# Altium schematic sheet WIFI-79.SchDoc
size A4
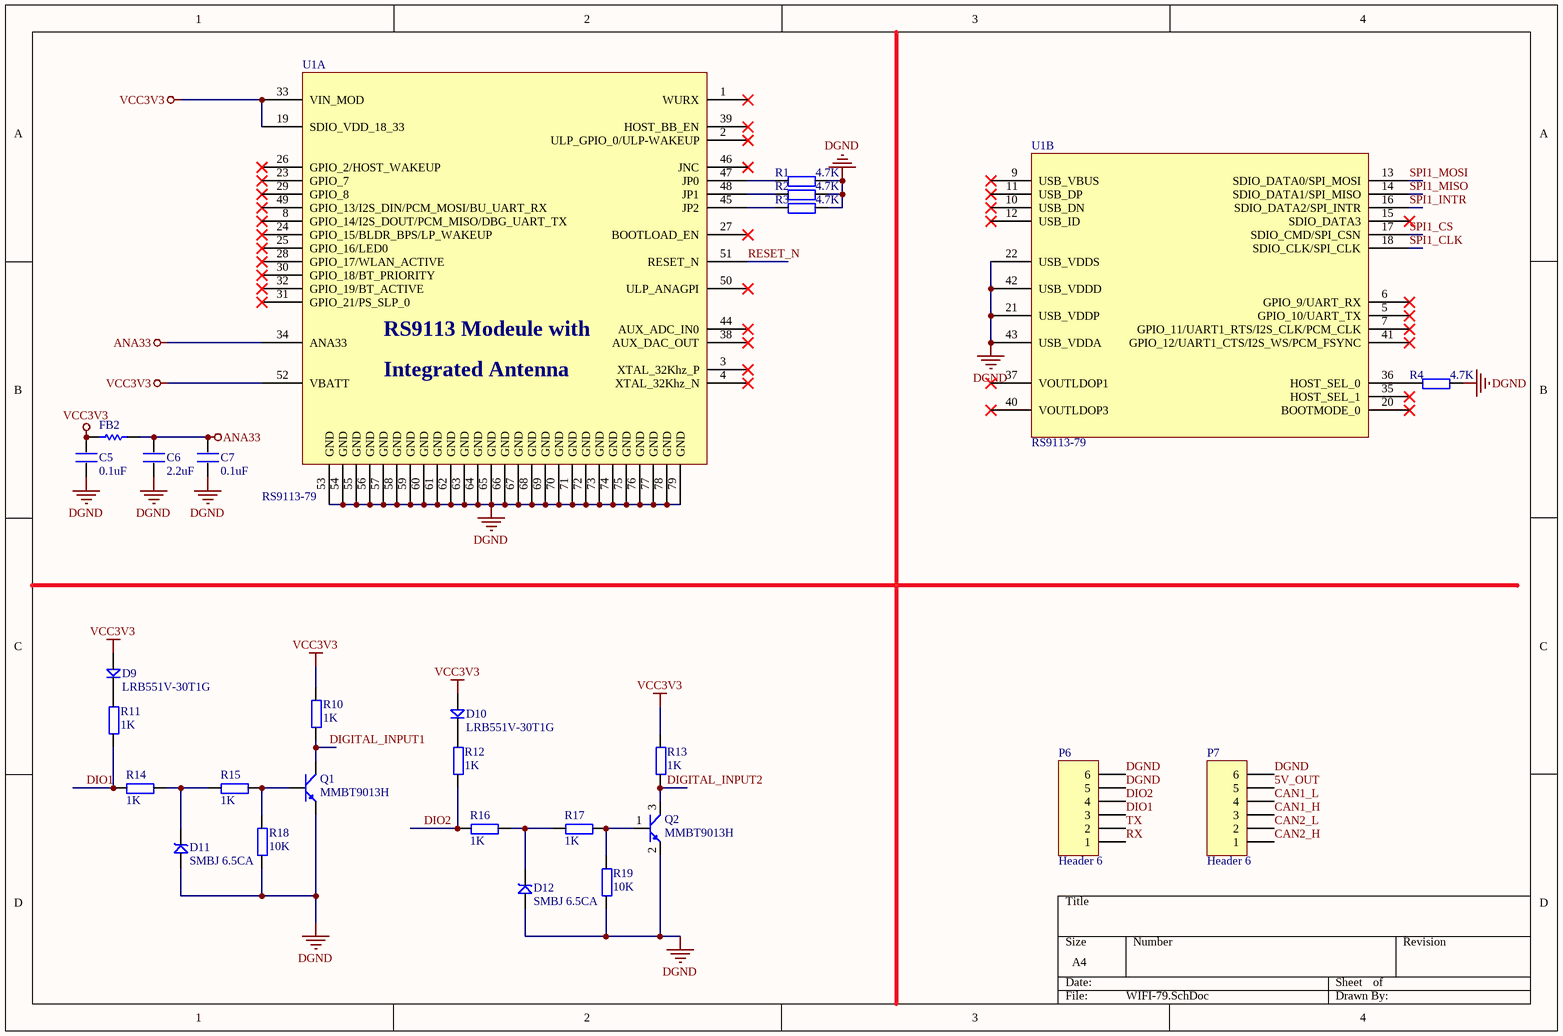
[diagram p0: WIFI-79.SchDoc]

## Parts
C5  0.1uF  [0603]
C6  2.2uF  [0603]
C7  0.1uF  [0603]
D9  LRB551V-30T1G  [SOD-323]
D10  LRB551V-30T1G  [SOD-323]
D11  SMBJ 6.5CA  [DO-214AA]
D12  SMBJ 6.5CA  [DO-214AA]
FB2  BLM15EG121SN1D  [0603]  (value not drawn)
P6  Header 6  [P6]
P7  Header 6  [P6]
Q1  MMBT9013H  [SOT-23]
Q2  MMBT9013H  [SOT-23]
R1  4.7K  [0603]
R2  4.7K  [0603]
R3  4.7K  [0603]
R4  4.7K  [0603]
R10  1K  [0603]
R11  1K  [0603]
R12  1K  [0603]
R13  1K  [0603]
R14  1K  [0603]
R15  1K  [0603]
R16  1K  [0603]
R17  1K  [0603]
R18  10K  [0603]
R19  10K  [0603]
U1  RS9113-79  [RS9113-79]  (parts A,B of 2)

## Nets
ANA33: C6.1 C7.1 FB2.2 U1.34(ANA33)
DGND: C5.2 C6.2 C7.2 D11.1 D12.1 P6.5 P6.6 P7.6 Q1.2(E) Q2.2(E) R1.2 R2.2 R3.2 R4.2 R18.1 R19.1 U1.21(USB_VDDP) U1.22(USB_VDDS) U1.42(USB_VDDD) U1.43(USB_VDDA) U1.53(GND) U1.54(GND) U1.55(GND) U1.56(GND) U1.57(GND) U1.58(GND) U1.59(GND) U1.60(GND) U1.61(GND) U1.62(GND) U1.63(GND) U1.64(GND) U1.65(GND) U1.66(GND) U1.67(GND) U1.68(GND) U1.69(GND) U1.70(GND) U1.71(GND) U1.72(GND) U1.73(GND) U1.74(GND) U1.75(GND) U1.76(GND) U1.77(GND) U1.78(GND) U1.79(GND)
VCC3V3: C5.1 D9.2 D10.2 FB2.1 R10.2 R13.2 U1.19(SDIO_VDD_18_33) U1.33(VIN_MOD) U1.52(VBATT)
5V_OUT: P7.5
CAN1_H: P7.3
CAN1_L: P7.4
CAN2_H: P7.1
CAN2_L: P7.2
DIGITAL_INPUT1: Q1.3(C) R10.1
DIGITAL_INPUT2: Q2.3(C) R13.1
DIO1: P6.3 R11.1 R14.1
DIO2: P6.4 R12.1 R16.1
RESET_N: U1.51(RESET_N)
RX: P6.1
SPI1_CLK: U1.18(SDIO_CLK/SPI_CLK)
SPI1_CS: U1.17(SDIO_CMD/SPI_CSN)
SPI1_INTR: U1.16(SDIO_DATA2/SPI_INTR)
SPI1_MISO: U1.14(SDIO_DATA1/SPI_MISO)
SPI1_MOSI: U1.13(SDIO_DATA0/SPI_MOSI)
TX: P6.2
NetD9_1: D9.1 R11.2
NetD10_1: D10.1 R12.2
NetD11_2: D11.2 R14.2 R15.1
NetD12_2: D12.2 R16.2 R17.1
NetQ1_1: Q1.1(B) R15.2 R18.2
NetQ2_1: Q2.1(B) R17.2 R19.2
NetR1_1: R1.1 U1.47(JP0)
NetR2_1: R2.1 U1.48(JP1)
NetR3_1: R3.1 U1.45(JP2)
NetR4_1: R4.1 U1.36(HOST_SEL_0)

Not connected (* = marked no-connect by the designer): U1 1(WURX)* 2(ULP_GPIO_0/ULP-WAKEUP)* 3(XTAL_32Khz_P)* 4(XTAL_32Khz_N)* 5(GPIO_10/UART_TX)* 6(GPIO_9/UART_RX)* 7(GPIO_11/UART1_RTS/I2S_CLK/PCM_CLK)* 8(GPIO_14/I2S_DOUT/PCM_MISO/DBG_UART_TX)* 9(USB_VBUS)* 10(USB_DN)* 11(USB_DP)* 12(USB_ID)* 15(SDIO_DATA3)* 20(BOOTMODE_0)* 23(GPIO_7)* 24(GPIO_15/BLDR_BPS/LP_WAKEUP)* 25(GPIO_16/LED0)* 26(GPIO_2/HOST_WAKEUP)* 27(BOOTLOAD_EN)* 28(GPIO_17/WLAN_ACTIVE)* 29(GPIO_8)* 30(GPIO_18/BT_PRIORITY)* 31(GPIO_21/PS_SLP_0)* 32(GPIO_19/BT_ACTIVE)* 35(HOST_SEL_1)* 37(VOUTLDOP1)* 38(AUX_DAC_OUT)* 39(HOST_BB_EN)* 40(VOUTLDOP3)* 41(GPIO_12/UART1_CTS/I2S_WS/PCM_FSYNC)* 44(AUX_ADC_IN0)* 46(JNC)* 49(GPIO_13/I2S_DIN/PCM_MOSI/BU_UART_RX)* 50(ULP_ANAGPI)*

## Notes on the sheet
- (in symbol RS9113-79, part A) RS9113 Modeule with; Integrated Antenna

## Library data of the parts
C5-C7 = C
D9 D10 = D_DIODE LRB: MAN: LRC; TPN: 1D-0000013-XX; MPN: LRB551V-30T1G
D11 D12 = SMBJ 6.5CA: TVS,SMBJ 6.5CA,600W SMD Transient Voltage Suppressor Diodes,; Terabits Part Number: 1D-0000001-XX; Manufacture: LRC; Part Type: Diode; Manufacture Part Number: SMBJ 6.5CA
FB2 = Res Semi: FILTER CHIP 120 OHM 1.5A 0402; Published: 8-Jun-2000; LatestRevisionDate: 17-Jul-2002; LatestRevisionNote: Re-released for DXP Platform.; PackageReference: AXIAL-0.5; Publisher: Altium Limited; PackageDescription: Axial Device, Thru-Hole; 2 Leads; 0.5 in Pin Spacing; Value: FILTER CHIP 120 OHM 1.5A 0402
P6 P7 = Header 6: 接插件; LatestRevisionDate: 17-Jul-2002; LatestRevisionNote: Re-released for DXP Platform.; Publisher: Altium Limited
Q1 Q2 = L2SC4617RT1G: Manufacture: LRC; Terabits Part Number: 1Q-0000001-XX; Part Type: Audion; Manufacture Part Number: L2SC4617RT1G
R1-R4 = R
R10 R13 R15 R17-R19 = R_1K: Res,1K,0603; Terabits Part Number: 1R-0000008-XX; Part Type: RES 0603
R11 R12 R14 R16 = R_1K: Res,1K,0603; TPN: 1R-0000008-XX